# EAGLE design IR_Recever_Card (EAGLE 6.4)

## Sheet 1 of 2
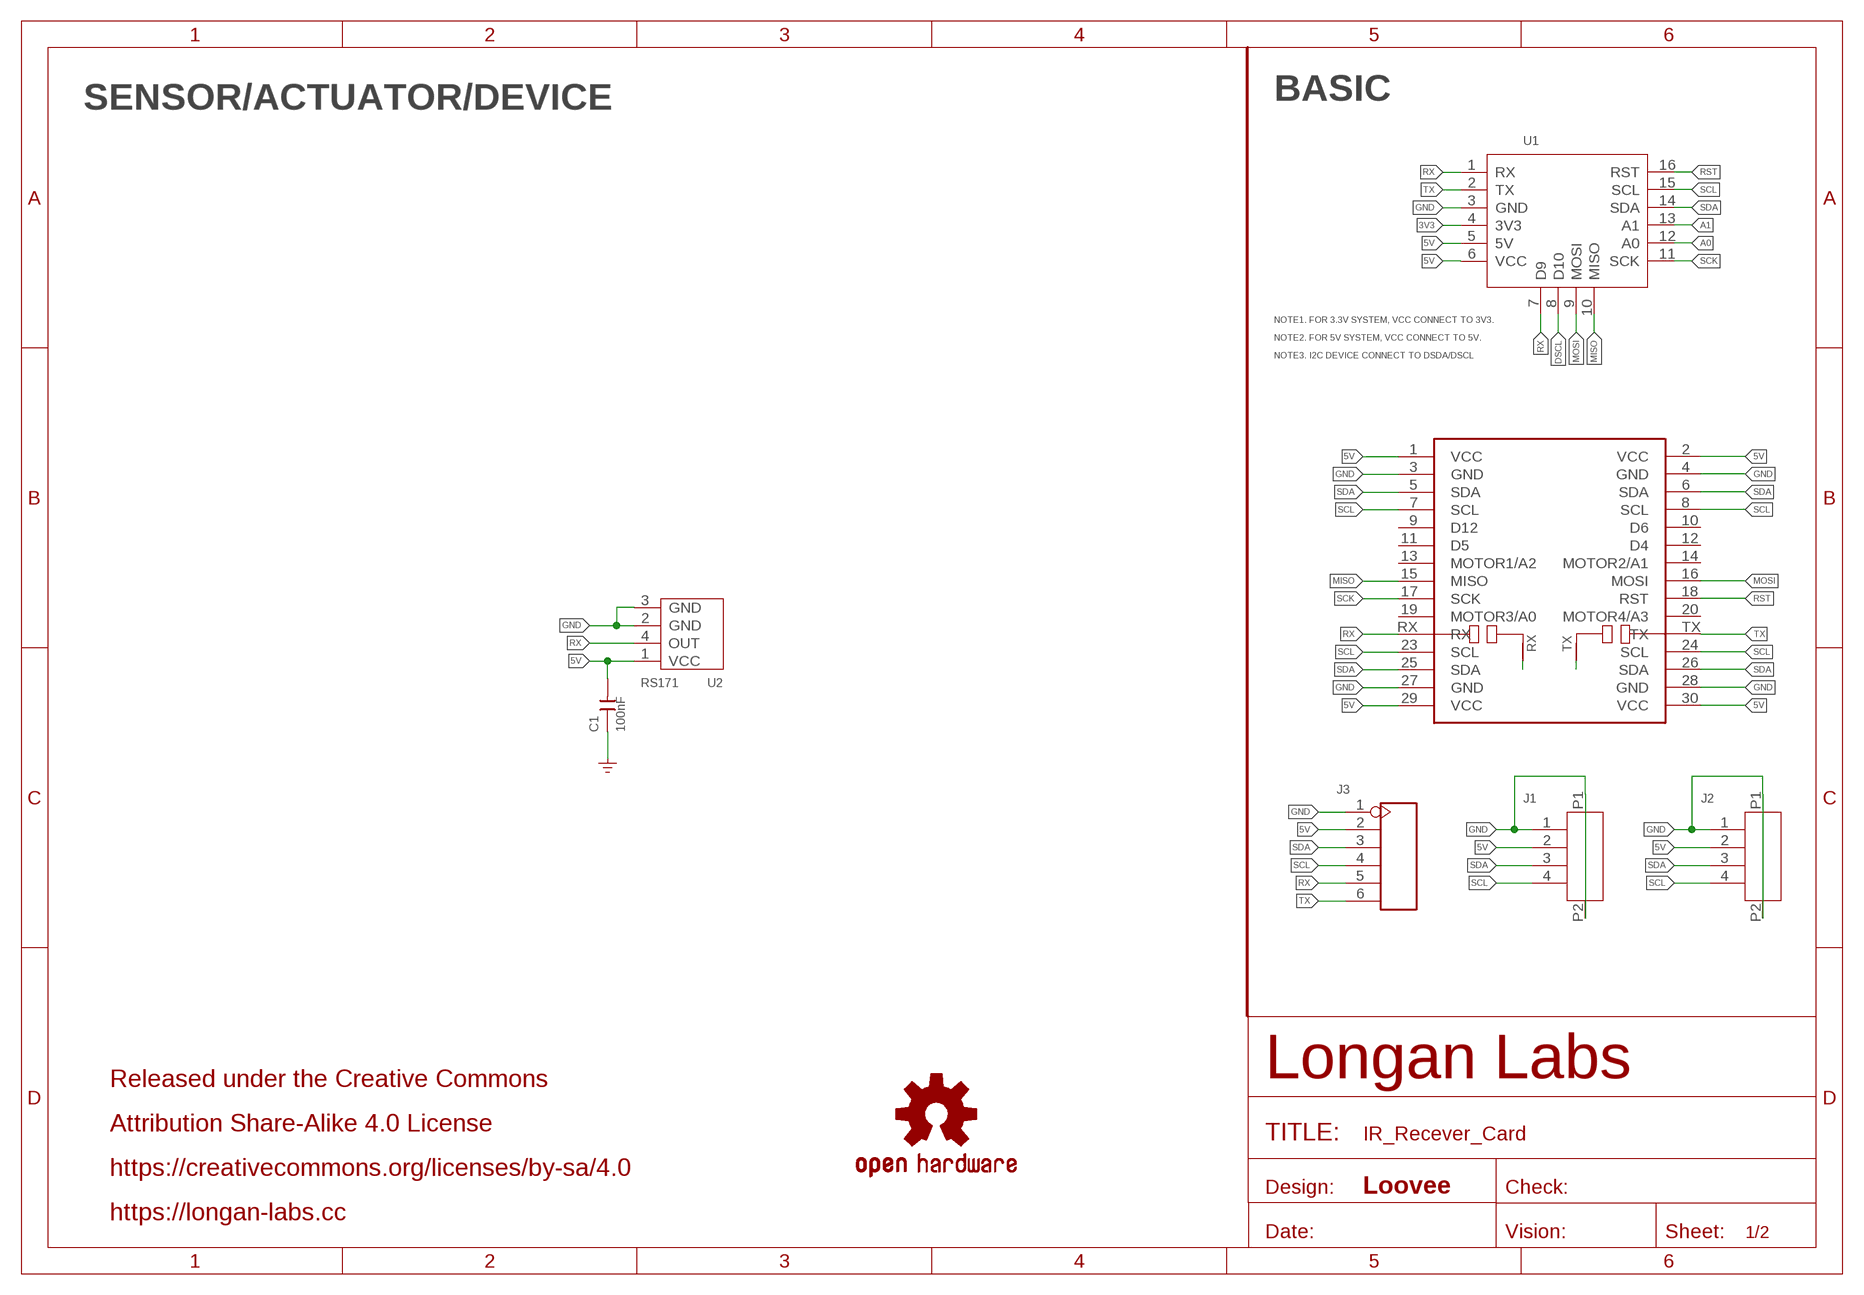
[diagram p0: schematic, sheet 1]

### Parts
C1  100nF  CAP-0603  [C0603]
J1  HEADER-4P-1.0  [4P-1.0-90D]
J2  HEADER-4P-1.0  [4P-1.0-90D]
J3  HEADER-6P-55/35MIL  [H6-2.54]
LOGO2  OSHW-LOGOS  [OSHW-LOGO-S]
MOUDLE1  MOUDLE-CARDS-UART'BOARD'  [MOUDLE-2X15P-UART]
U1  MOUDLE-CARDS  [16P-2.0-CARDS]
U2  RS171  RS-171  [4P-SMD-L7.6*W5.75MM]

### Nets
3V3: U1.4(3V3)
5V: C1.2 J1.2 J2.2 J3.2 MOUDLE1.1(VCC) MOUDLE1.2(VCC) MOUDLE1.29(VCC) MOUDLE1.30(VCC) U1.5(5V) U1.6(VCC) U2.1(VCC)
A0: U1.12(A0)
A1: U1.13(A1)
DSCL: U1.8(D10)
GND: C1.1 J1.1 J1.P1 J1.P2 J2.1 J2.P1 J2.P2 J3.1 MOUDLE1.3(GND) MOUDLE1.4(GND) MOUDLE1.27(GND) MOUDLE1.28(GND) U1.3(GND) U2.2(GND) U2.3(GND) ; supply symbol labelled GND_POWER
MISO: MOUDLE1.15(MISO) U1.10(MISO)
MOSI: MOUDLE1.16(MOSI) U1.9(MOSI)
N$1: MOUDLE1.RX/N1(RX/N) MOUDLE1.RX/N2(RX/N)
N$2: MOUDLE1.TX/N1(TX/N) MOUDLE1.TX/N2(TX/N)
RST: MOUDLE1.18(RST) U1.16(RST)
RX: J3.5 MOUDLE1.RX U1.1(RX) U1.7(D9) U2.4(OUT)
SCK: MOUDLE1.17(SCK) U1.11(SCK)
SCL: J1.4 J2.4 J3.4 MOUDLE1.7(SCL) MOUDLE1.8(SCL) MOUDLE1.23(SCL) MOUDLE1.24(SCL) U1.15(SCL)
SDA: J1.3 J2.3 J3.3 MOUDLE1.5(SDA) MOUDLE1.6(SDA) MOUDLE1.25(SDA) MOUDLE1.26(SDA) U1.14(SDA)
TX: J3.6 MOUDLE1.TX U1.2(TX)
Unconnected: MOUDLE1.9(D12) MOUDLE1.10(D6) MOUDLE1.11(D5) MOUDLE1.12(D4) MOUDLE1.13(MOTOR1/A2) MOUDLE1.14(MOTOR2/A1) MOUDLE1.19(MOTOR3/A0) MOUDLE1.20(MOTOR4/A3)

### Notes on the sheet
- SENSOR/ACTUATOR/DEVICE | BASIC
- NOTE1. FOR 3.3V SYSTEM, VCC CONNECT TO 3V3.
- NOTE2. FOR 5V SYSTEM, VCC CONNECT TO 5V.
- NOTE3. I2C DEVICE CONNECT TO DSDA/DSCL
- Released under the Creative Commons
- Attribution Share-Alike 4.0 License
- https://creativecommons.org/licenses/by-sa/4.0
- Loovee
- https://longan-labs.cc

## Sheet 2 of 2

## Library data of the parts
C1 = Discrete-new:CAP: Ceramic Capacitors
J1 J2 = Longan-Connect:HEADER-4P-1.0
J3 = Connector-new:HEADER-6P
LOGO2 = SparkFun-Aesthetics:OSHW-LOGO: Open-Source Hardware (OSHW) Logo This logo indicates the piece of hardware it is found on incorporates a OSHW license and/or adheres to the definition of open source hardware found here: http://freedomdefined.org/OSHW
MOUDLE1 = Longan-moudle:MOUDLE-CARDS-UART
U1 = MOUDLE-CARDS:MOUDLE-CARDS
U2 = dwin:RS-171

## Net classes
0 default: width 0.152 mm, drill 0.254 mm, clearance 0.152 mm

## Board
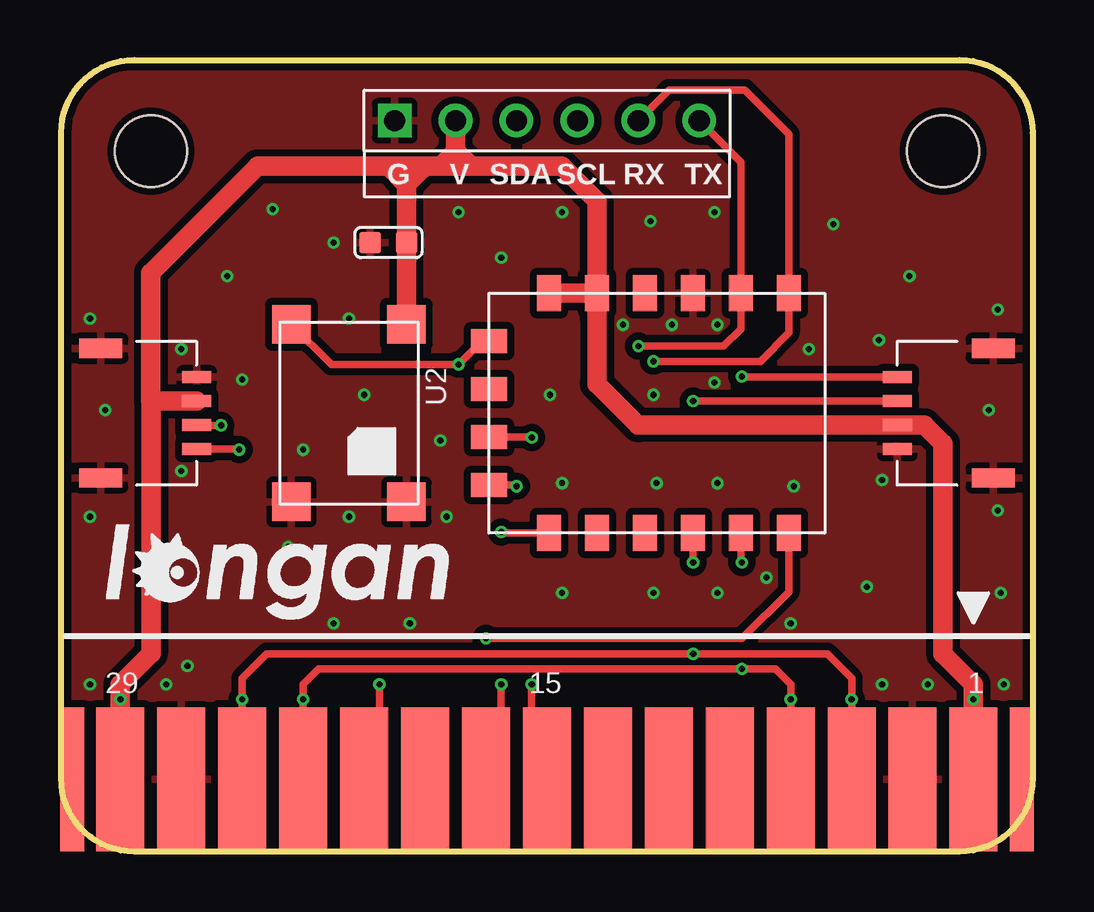
[diagram p1: board, top side]
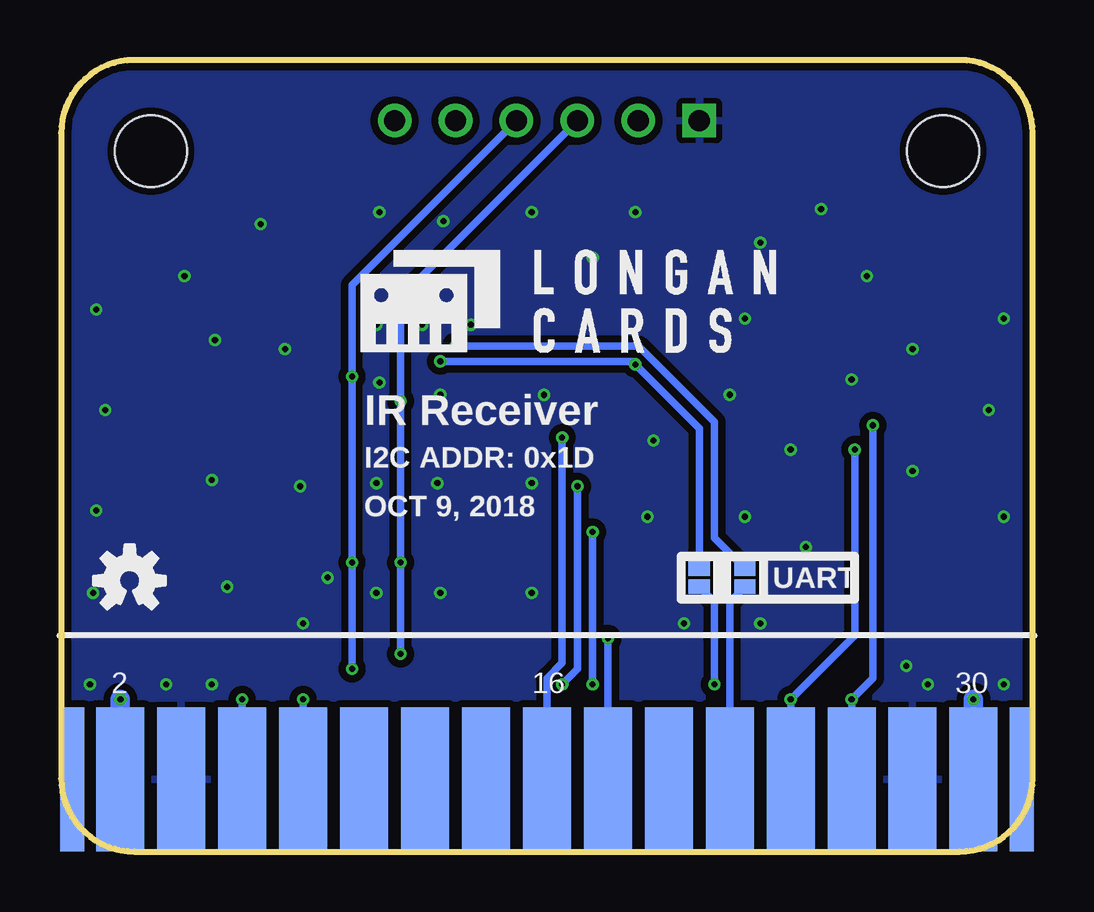
[diagram p2: board, bottom side, seen from below]

Size 40.5 x 33 mm. Coordinates in mm from the lower left corner, seen from the top.
Copper layers (1*16): Top 0.035mm / dielectric 1.5mm / Bottom 0.035mm
Design rules "SeeedStudio_2layer_DRU_no_angle_20140221": minimum track width 1mil, minimum drill 10mil, track to track 6mil, track to pad 6mil, pad to pad 6mil, via to via 6mil, smd to smd 0mil, copper to edge 10mil, drill to drill 10mil, minimum pad ring 4mil, minimum via ring 4mil, stop-mask expansion 2mil, vias tented up to drill 25mil, thermal gap 10mil

### Footprints (pad centres in the part's own frame; a part is rotated, then mirrored left to right if it is on the bottom)
C0603 = smd 0.889 x 0.889: 1 0,0.762; 2 0,-0.762
4P-1.0-90D = smd 1.2 x 0.5: 1 0,1.5; 2 0,0.5; 3 0,-0.5; 4 0,-1.5 | smd 1.8 x 0.8: P1 -4,2.7; P2 -4,-2.7
H6-2.54 = drill 0.889 pad 1.397 square: 1 0,6.35 | drill 0.889 pad 1.397: 2 0,3.81; 3 0,1.27; 4 0,-1.27; 5 0,-3.81; 6 0,-6.35
MOUDLE-2X15P-UART = smd 2 x 6: 1 17.78,-13.492; 3 15.24,-13.492; 5 12.7,-13.492; 7 10.16,-13.492; 9 7.62,-13.492; 11 5.08,-13.492; 13 2.54,-13.492; 15 0,-13.492; 17 -2.54,-13.492; 19 -5.08,-13.492; 23 -10.16,-13.492; 25 -12.7,-13.492; 27 -15.24,-13.492; 29 -17.78,-13.492; RX/N2 -7.62,-13.492 | smd 2 x 6 bottom: 2 17.78,-13.492; 4 15.24,-13.492; 6 12.7,-13.492; 8 10.16,-13.492; 10 7.62,-13.492; 12 5.08,-13.492; 14 2.54,-13.492; 16 0,-13.492; 18 -2.54,-13.492; 20 -5.08,-13.492; 24 -10.16,-13.492; 26 -12.7,-13.492; 28 -15.24,-13.492; 30 -17.78,-13.492; TX/N2 -7.62,-13.492 | smd 1 x 6: P1 -19.8,-13.492; P4 19.8,-13.492 | smd 1 x 6 bottom: P2 -19.8,-13.492; P3 19.8,-13.492 | smd 0.889 x 0.61 bottom: RX -6.35,-4.699; RX/N1 -6.35,-5.461; TX -8.255,-4.699; TX/N1 -8.255,-5.461 | hole 3: -16.51,12.7; 16.51,12.7
16P-2.0-CARDS = smd 1.5 x 1: 1 -5,5; 2 -5,3; 3 -5,1; 4 -5,-1; 5 -5,-3; 6 -5,-5; 11 5,-5; 12 5,-3; 13 5,-1; 14 5,1; 15 5,3; 16 5,5 | smd 1 x 1.5: 7 -3,-7.5; 8 -1,-7.5; 9 1,-7.5; 10 3,-7.5
4P-SMD-L7.6*W5.75MM = smd 1.6 x 1.6: 1 -3.7,2.4; 2 3.7,2.4; 3 3.7,-2.4; 4 -3.7,-2.4

### Placement (x,y rotation side)
C1  13.65,25.39 90 top
J1  5.64,18.28 0 top
J2  34.86,18.28 180 top
J3  20.25,30.47 90 top
LOGO2  37.65,11.29 0 bottom
MOUDLE1  20.25,16.5 0 top
U1  25.33,18.28 270 top
U2  11.99,18.28 270 top
U$1  [LONGAN-CARDS-MIDDLE]  28.76,20.31 0 bottom
U$2  [LONGAN-SILK-SMALLER]  0.57,8.5 0 top

### Tracks (layer width: path | path; a pad name or v marks a point on that pad's centre or on a via)
5V  (via drill 0.25 pad 0.51)
  Top 0.152: U1.6 20.33,23.95
  Top 0.508: U1.5 22.33,22.24 | 38.03,6.47 v38.03,6.34
  Top 0.813: 3.75,18.78 3.75,8.25 2.47,6.97 v2.47,6.34 MOUDLE1.30 | 13.65,28.56 8.19,28.56 3.74,24.12 3.74,18.79 3.75,18.78 | 13.65,28.56 14.41,28.56 | 3.75,18.78 J1.2 | 22.41,23.23 22.33,23.15 22.33,22.24 22.33,19.5 24.05,17.78 J2.2 35.99,17.78 36.76,17.01 36.76,8.24 38.03,6.97 38.03,6.47 MOUDLE1.2 | U2.1 14.39,25.38 C1.2 14.41,27.8 | 14.41,27.8 14.41,28.56 | 14.41,28.56 15.8,28.56 | 15.8,28.56 16.57,28.56 | 16.57,28.56 17.07,28.56 | 17.07,28.56 20.89,28.56 22.33,27.12 U1.5 U1.6 | J3.2 16.44,29.2 | 16.44,29.2 16.44,28.69 16.57,28.56 | 16.44,29.2 17.07,28.56 | 16.44,29.2 15.8,28.56 | 14.41,27.8 13.65,28.56 | 14.41,27.8 15.04,28.44
  Bottom 0.813: v2.47,6.34 MOUDLE1.30 | v38.03,6.34 MOUDLE1.2
GND  (via drill 0.25 pad 0.51)
  other vias: 34.22,6.97 36.12,6.97 39.3,6.97 4.38,6.97 5.26,7.74 1.2,6.97 1.84,18.41 5.01,15.87 1.2,13.96 1.2,22.21 5.01,20.95 18.34,24.76 11.99,22.21 25.46,21.96 27.36,21.96 23.43,21.96 24.7,19.04 27.23,19.55 20.38,19.04 20.89,15.36 24.82,15.36 27.36,15.36 30.54,15.23 38.66,18.41 39.05,22.6 39.05,14.21 34.22,15.48 34.09,21.33 27.23,26.66 24.57,26.28 31.17,20.95 32.19,26.15 35.36,23.99 33.59,11.04 39.17,10.79 7.55,19.68 11.36,25.39 16.57,26.66 20.89,26.66 8.82,26.79 6.91,23.99 10.09,16.75 11.99,13.96 16.06,13.96 15.8,17.14 9.46,12.69 11.36,9.52 14.54,9.52 20.89,10.79 24.7,10.79 27.36,10.79 29.39,11.42 30.41,9.52 12.63,19.04
  pour Top (isolate 0.305): -0.07,33.01 40.57,33.01 40.57,-0.01 -0.07,-0.01
  pour Bottom (isolate 0.305): -0.07,33.01 40.57,33.01 40.57,-0.01 -0.07,-0.01
MISO  (via drill 0.25 pad 0.51)
  Top 0.305: U1.10 18.93,15.28 v18.98,15.23 | v19.61,6.97 19.61,3.64 MOUDLE1.15
  Bottom 0.305: v18.98,15.23 18.98,7.61 v19.61,6.97
MOSI  (via drill 0.25 pad 0.51)
  Top 0.305: U1.9 19.6,17.28 v19.61,17.26
  Bottom 0.305: v19.61,17.26 19.61,7.86 20.25,7.23 MOUDLE1.16
N$1  (via drill 0.25 pad 0.51)
  Top 0.305: MOUDLE1.RX/N2 12.63,4.44 13.27,5.07 v13.27,6.97
  Bottom 0.305: v13.27,6.97 13.27,10.4 MOUDLE1.RX/N1
N$2
  Bottom 0.305: MOUDLE1.TX/N2 12.63,10.4 MOUDLE1.TX/N1
RST  (via drill 0.25 pad 0.51)
  Top 0.305: U1.16 30.33,10.83 28.38,8.88 v17.71,8.88
  Bottom 0.305: v17.71,8.88 MOUDLE1.18
RX  (via drill 0.25 pad 0.51)
  Top 0.305: J3.5 25.33,31.74 28.51,31.74 30.33,29.91 U1.1 30.33,21.63 29.14,20.44 v24.7,20.44 | U2.4 11.26,20.31 v16.57,20.31 17.54,21.28 U1.7 18.01,21.28
  Bottom 0.305: v24.7,20.44 16.69,20.44 v16.57,20.31 13.9,17.64 MOUDLE1.RX
SCK  (via drill 0.25 pad 0.51)
  Top 0.305: U1.11 18.39,13.28 v18.34,13.32 | v18.34,6.97 18.34,3.64 MOUDLE1.17
  Bottom 0.305: v18.34,13.32 v18.34,6.97
SCL  (via drill 0.25 pad 0.51)
  Top 0.305: U1.15 28.33,12.1 v28.38,12.05 | J2.4 28.4,19.78 v28.38,19.8 | J1.4 7.4,16.78 v7.42,16.75 | MOUDLE1.23 v10.09,6.34 10.09,6.97 10.72,7.61 v28.38,7.61 29.77,7.61 30.41,6.97 v30.41,6.34 MOUDLE1.8
  Bottom 0.305: J3.4 28.38,23.61 v28.38,19.8 v28.38,12.05 v28.38,7.61 | v7.42,16.75 7.42,9.01 v10.09,6.34 MOUDLE1.23 | v30.41,6.34 MOUDLE1.8
SDA  (via drill 0.25 pad 0.51)
  Top 0.305: U1.14 26.33,12.07 v26.35,12.05 | J2.3 26.35,18.78 v26.35,18.79 | v6.66,17.77 5.65,17.77 J1.3 | MOUDLE1.25 v7.55,6.34 7.55,7.23 8.57,8.24 v26.35,8.24 31.93,8.24 32.95,7.23 v32.95,6.34 MOUDLE1.6
  Bottom 0.305: J3.3 26.35,23.1 v26.35,18.79 v26.35,12.05 v26.35,8.24 | v6.66,17.77 6.66,7.23 v7.55,6.34 MOUDLE1.25 | v32.95,6.34 MOUDLE1.6
TX  (via drill 0.25 pad 0.51)
  Top 0.305: J3.6 28.33,28.74 U1.2 28.33,21.79 27.62,21.07 v24.06,21.07
  Bottom 0.305: v24.06,21.07 16.44,21.07 13.27,17.9 13.27,13.07 MOUDLE1.TX

### Text on the board
tPlace: G | V | SDA | SCL | RX | TX
bPlace: IR Receiver | I2C ADDR: 0x1D | OCT 9, 2018